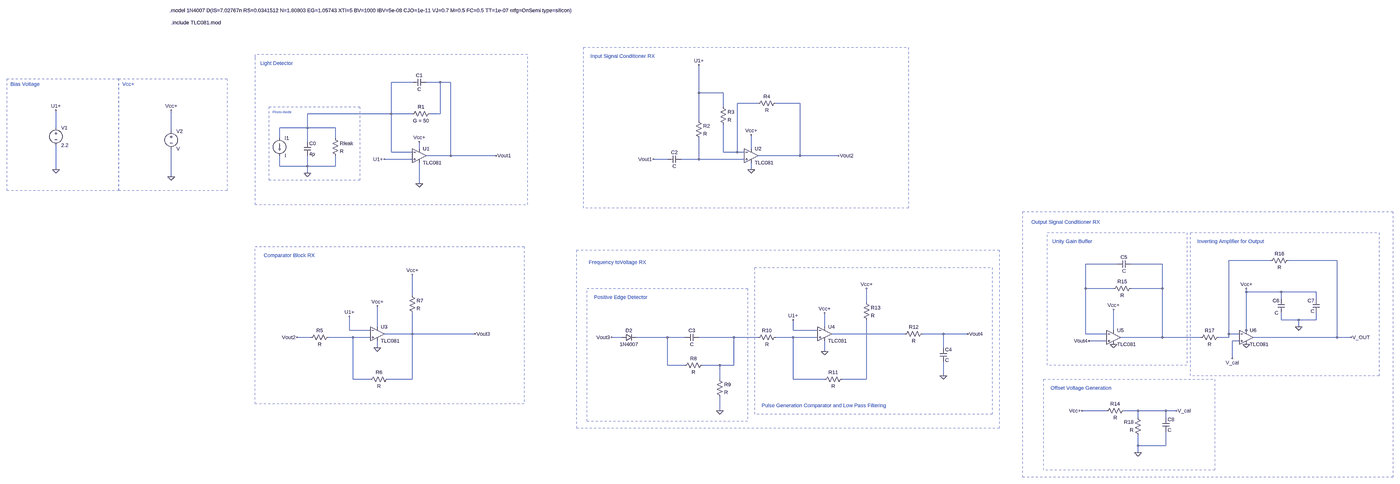
[diagram p0: schematic Receiver-design.asc, whole sheet]
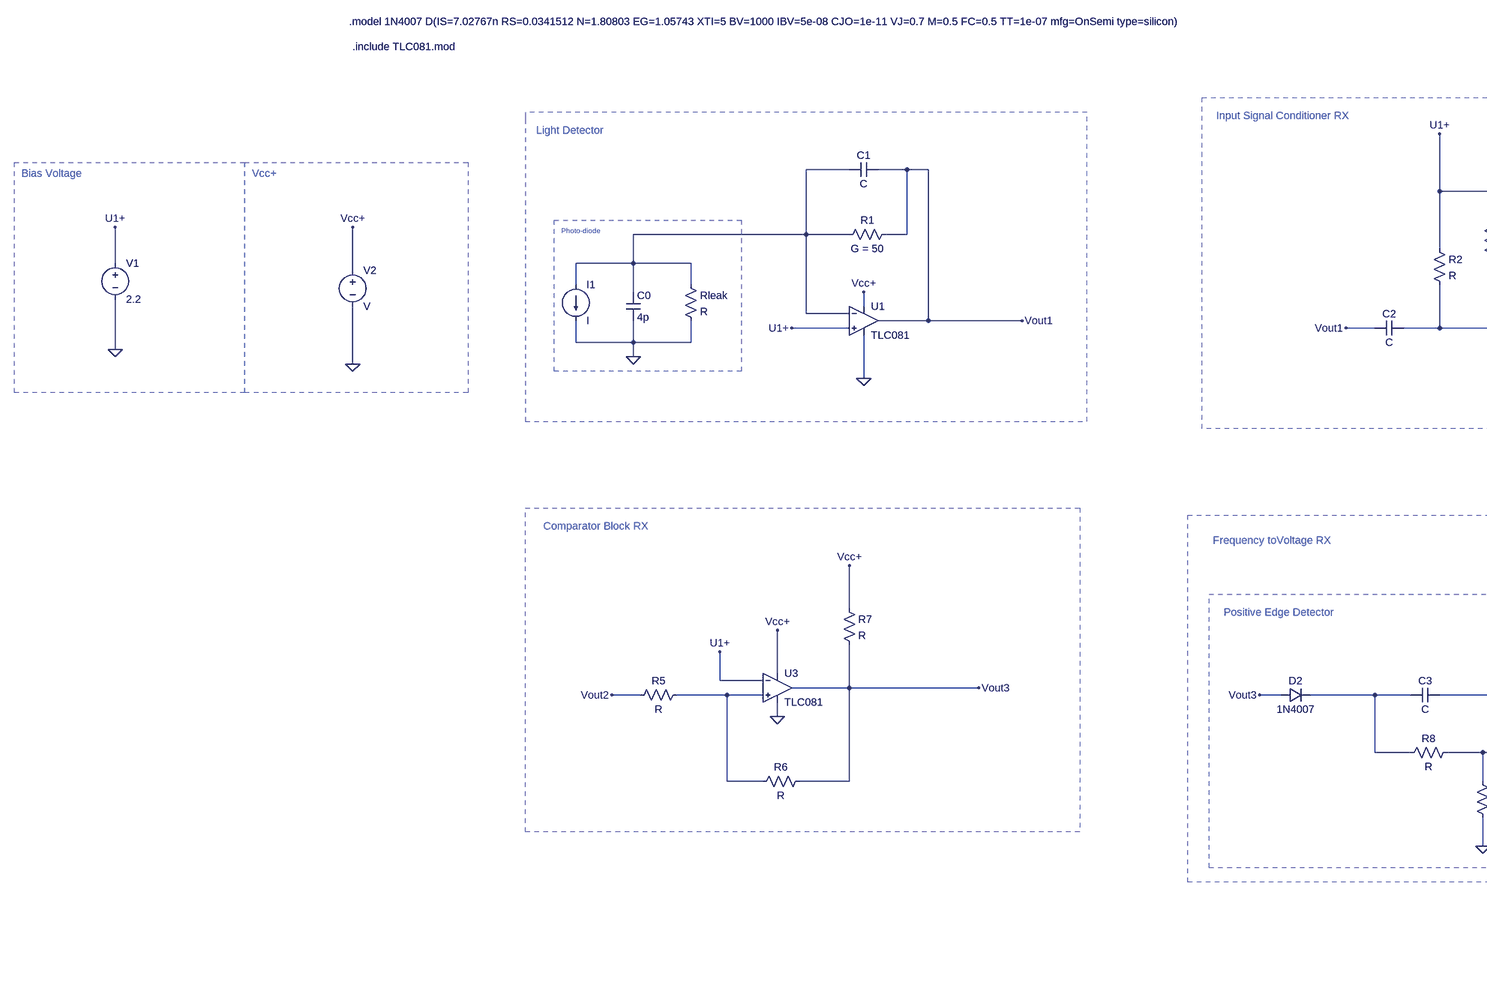
[diagram p1: schematic Receiver-design.asc, part, row 1 of 1, column 1 of 2]
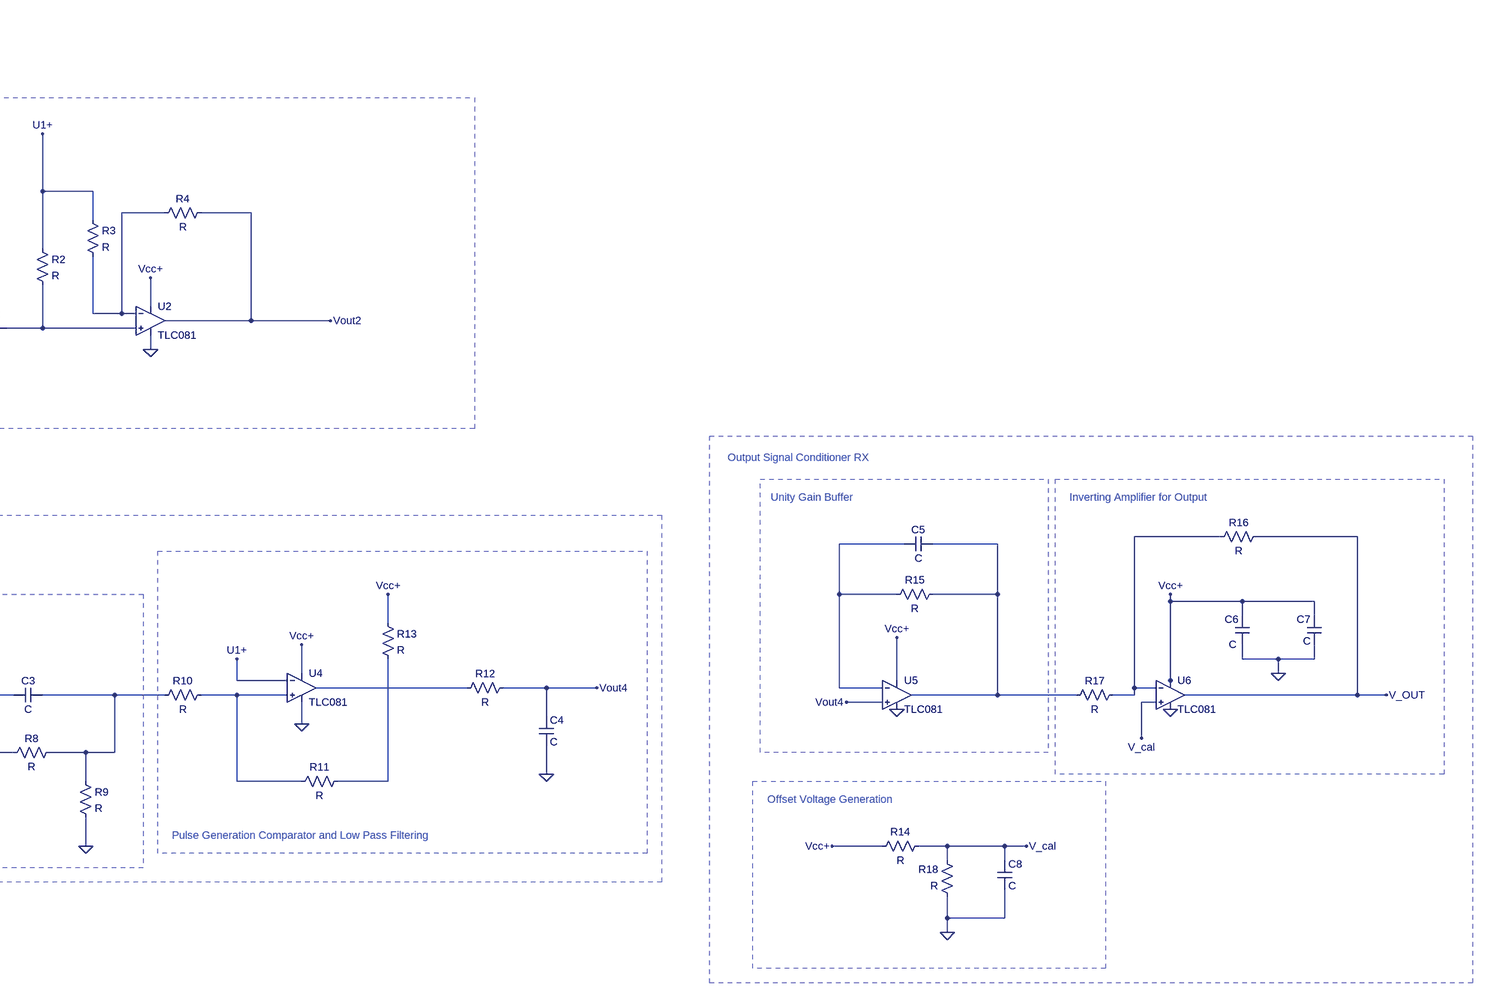
[diagram p2: schematic Receiver-design.asc, part, row 1 of 1, column 2 of 2]
Receiver-design.asc, the LTspice schematic file:
Version 4
SHEET 1 5204 1204
WIRE 704 -608 608 -608
WIRE 832 -608 768 -608
WIRE 880 -608 832 -608
WIRE 2016 -560 2016 -688
WIRE 2128 -560 2016 -560
WIRE 2288 -512 2192 -512
WIRE 2480 -512 2368 -512
WIRE 2128 -496 2128 -560
WIRE 608 -464 608 -608
WIRE 608 -464 224 -464
WIRE 704 -464 608 -464
WIRE 832 -464 832 -608
WIRE 832 -464 784 -464
WIRE 2016 -432 2016 -560
WIRE -928 -400 -928 -480
WIRE 224 -400 224 -464
WIRE 224 -400 96 -400
WIRE 352 -400 224 -400
WIRE -400 -384 -400 -480
WIRE 96 -352 96 -400
WIRE 352 -352 352 -400
WIRE 224 -336 224 -400
WIRE 736 -304 736 -336
WIRE 2256 -304 2256 -368
WIRE 608 -288 608 -464
WIRE 704 -288 608 -288
WIRE 2128 -288 2128 -416
WIRE 2192 -288 2192 -512
WIRE 2192 -288 2128 -288
WIRE 2224 -288 2192 -288
WIRE 880 -272 880 -608
WIRE 880 -272 768 -272
WIRE 1088 -272 880 -272
WIRE 2480 -272 2480 -512
WIRE 2480 -272 2288 -272
WIRE 2656 -272 2480 -272
WIRE 704 -256 576 -256
WIRE 1872 -256 1808 -256
WIRE 2016 -256 2016 -352
WIRE 2016 -256 1936 -256
WIRE 2224 -256 2016 -256
WIRE 96 -224 96 -272
WIRE 224 -224 224 -272
WIRE 224 -224 96 -224
WIRE 352 -224 352 -272
WIRE 352 -224 224 -224
WIRE -928 -208 -928 -320
WIRE 2256 -208 2256 -240
WIRE 224 -192 224 -224
WIRE -400 -176 -400 -304
WIRE 736 -144 736 -240
WIRE 4640 208 4448 208
WIRE 4944 208 4720 208
WIRE 3936 224 3792 224
WIRE 4144 224 4000 224
WIRE 3792 336 3792 224
WIRE 3920 336 3792 336
WIRE 4144 336 4144 224
WIRE 4144 336 4000 336
WIRE 4528 352 4528 336
WIRE 4688 352 4528 352
WIRE 4848 352 4688 352
WIRE 704 368 704 272
WIRE 4688 384 4688 352
WIRE 4848 384 4848 352
WIRE 2784 400 2784 336
WIRE 4688 480 4688 448
WIRE 4768 480 4688 480
WIRE 4848 480 4848 448
WIRE 4848 480 4768 480
WIRE 544 512 544 416
WIRE 2592 512 2592 448
WIRE 4768 512 4768 480
WIRE 416 528 416 464
WIRE 512 528 416 528
WIRE 2448 528 2448 480
WIRE 2560 528 2448 528
WIRE 3920 528 3920 432
WIRE 4528 528 4528 352
WIRE 704 544 704 448
WIRE 704 544 576 544
WIRE 992 544 704 544
WIRE 2960 544 2624 544
WIRE 3136 544 3040 544
WIRE 3248 544 3136 544
WIRE 3792 544 3792 336
WIRE 3888 544 3792 544
WIRE 4448 544 4448 208
WIRE 4496 544 4448 544
WIRE 4528 544 4528 528
WIRE 240 560 176 560
WIRE 432 560 320 560
WIRE 512 560 432 560
WIRE 1664 560 1616 560
WIRE 1872 560 1728 560
WIRE 1952 560 1872 560
WIRE 2176 560 2016 560
WIRE 2288 560 2176 560
WIRE 2448 560 2368 560
WIRE 2560 560 2448 560
WIRE 4144 560 4144 336
WIRE 4144 560 3952 560
WIRE 4320 560 4144 560
WIRE 4448 560 4448 544
WIRE 4448 560 4400 560
WIRE 4944 560 4944 208
WIRE 4944 560 4560 560
WIRE 5008 560 4944 560
WIRE 3888 576 3808 576
WIRE 4496 576 4464 576
WIRE 544 608 544 576
WIRE 3136 608 3136 544
WIRE 2592 624 2592 576
WIRE 4464 656 4464 576
WIRE 1872 688 1872 560
WIRE 1952 688 1872 688
WIRE 2112 688 2032 688
WIRE 2176 688 2176 560
WIRE 2176 688 2112 688
WIRE 3136 736 3136 672
WIRE 432 752 432 560
WIRE 512 752 432 752
WIRE 704 752 704 544
WIRE 704 752 592 752
WIRE 2112 752 2112 688
WIRE 2448 752 2448 560
WIRE 2592 752 2448 752
WIRE 2784 752 2784 480
WIRE 2784 752 2672 752
WIRE 2112 896 2112 832
WIRE 3888 896 3776 896
WIRE 4032 896 3968 896
WIRE 4160 896 4032 896
WIRE 4208 896 4160 896
WIRE 4032 928 4032 896
WIRE 4160 928 4160 896
WIRE 4032 1056 4032 1008
WIRE 4160 1056 4160 992
WIRE 4160 1056 4032 1056
WIRE 4032 1088 4032 1056
FLAG 224 -192 0
FLAG 736 -144 0
FLAG 736 -336 Vcc+
FLAG 576 -256 U1+
FLAG 1088 -272 Vout1
FLAG 2256 -208 0
FLAG 2256 -368 Vcc+
FLAG 1808 -256 Vout1
FLAG 2656 -272 Vout2
FLAG 176 560 Vout2
FLAG 544 608 0
FLAG 544 416 Vcc+
FLAG 704 272 Vcc+
FLAG 992 544 Vout3
FLAG 2112 896 0
FLAG 1616 560 Vout3
FLAG 2592 624 0
FLAG 2592 448 Vcc+
FLAG 2784 336 Vcc+
FLAG 3136 736 0
FLAG 3248 544 Vout4
FLAG 2448 480 U1+
FLAG 416 464 U1+
FLAG 2016 -688 U1+
FLAG -928 -480 U1+
FLAG -928 -208 0
FLAG 3920 592 0
FLAG 4528 592 0
FLAG 4032 1088 0
FLAG 4768 512 0
FLAG 3920 432 Vcc+
FLAG 4528 336 Vcc+
FLAG 3808 576 Vout4
FLAG 3776 896 Vcc+
FLAG 4208 896 V_cal
FLAG 4464 656 V_cal
FLAG 5008 560 V_OUT
FLAG -400 -176 0
FLAG -400 -480 Vcc+
SYMBOL res 800 -480 R90
WINDOW 0 0 56 VBottom 2
WINDOW 3 32 56 VTop 2
SYMATTR InstName R1
SYMATTR Value G = 50
SYMBOL cap 768 -624 R90
WINDOW 0 0 32 VBottom 2
WINDOW 3 32 32 VTop 2
SYMATTR InstName C1
SYMBOL OpAmps\\opamp2 736 -336 R0
SYMATTR InstName U1
SYMATTR Value TLC081
SYMBOL cap 1936 -272 R90
WINDOW 0 0 32 VBottom 2
WINDOW 3 32 32 VTop 2
SYMATTR InstName C2
SYMBOL OpAmps\\opamp2 2256 -336 R0
SYMATTR InstName U2
SYMATTR Value TLC081
SYMBOL res 2000 -448 R0
SYMATTR InstName R2
SYMBOL res 2112 -512 R0
SYMATTR InstName R3
SYMBOL res 2384 -528 R90
WINDOW 0 0 56 VBottom 2
WINDOW 3 32 56 VTop 2
SYMATTR InstName R4
SYMBOL OpAmps\\opamp2 544 480 R0
SYMATTR InstName U3
SYMATTR Value TLC081
SYMBOL res 336 544 R90
WINDOW 0 0 56 VBottom 2
WINDOW 3 32 56 VTop 2
SYMATTR InstName R5
SYMBOL res 608 736 R90
WINDOW 0 0 56 VBottom 2
WINDOW 3 32 56 VTop 2
SYMATTR InstName R6
SYMBOL res 688 352 R0
SYMATTR InstName R7
SYMBOL OpAmps\\opamp2 2592 480 R0
SYMATTR InstName U4
SYMATTR Value TLC081
SYMBOL diode 1664 576 R270
WINDOW 0 32 32 VTop 2
WINDOW 3 0 32 VBottom 2
SYMATTR InstName D2
SYMATTR Value 1N4007
SYMBOL cap 2016 544 R90
WINDOW 0 0 32 VBottom 2
WINDOW 3 32 32 VTop 2
SYMATTR InstName C3
SYMBOL res 2048 672 R90
WINDOW 0 0 56 VBottom 2
WINDOW 3 32 56 VTop 2
SYMATTR InstName R8
SYMBOL res 2096 736 R0
SYMATTR InstName R9
SYMBOL res 2384 544 R90
WINDOW 0 0 56 VBottom 2
WINDOW 3 32 56 VTop 2
SYMATTR InstName R10
SYMBOL res 2688 736 R90
WINDOW 0 0 56 VBottom 2
WINDOW 3 32 56 VTop 2
SYMATTR InstName R11
SYMBOL res 3056 528 R90
WINDOW 0 0 56 VBottom 2
WINDOW 3 32 56 VTop 2
SYMATTR InstName R12
SYMBOL res 2768 384 R0
SYMATTR InstName R13
SYMBOL cap 3120 608 R0
SYMATTR InstName C4
SYMBOL voltage -928 -416 R0
WINDOW 123 0 0 Left 0
WINDOW 39 0 0 Left 0
SYMATTR InstName V1
SYMATTR Value 2.2
SYMBOL current 96 -352 R0
SYMATTR InstName I1
SYMBOL cap 208 -336 R0
SYMATTR InstName C0
SYMATTR Value 4p
SYMBOL res 336 -368 R0
SYMATTR InstName Rleak
SYMBOL res 4016 320 R90
WINDOW 0 0 56 VBottom 2
WINDOW 3 32 56 VTop 2
SYMATTR InstName R15
SYMBOL res 4736 192 R90
WINDOW 0 0 56 VBottom 2
WINDOW 3 32 56 VTop 2
SYMATTR InstName R16
SYMBOL res 4416 544 R90
WINDOW 0 0 56 VBottom 2
WINDOW 3 32 56 VTop 2
SYMATTR InstName R17
SYMBOL cap 4000 208 R90
WINDOW 0 0 32 VBottom 2
WINDOW 3 32 32 VTop 2
SYMATTR InstName C5
SYMBOL cap 4704 448 R180
WINDOW 0 24 56 Left 2
WINDOW 3 29 0 Left 2
SYMATTR InstName C6
SYMBOL cap 4864 448 R180
WINDOW 0 24 56 Left 2
WINDOW 3 24 8 Left 2
SYMATTR InstName C7
SYMBOL OpAmps\\opamp2 3920 496 R0
SYMATTR InstName U5
SYMATTR Value TLC081
SYMBOL OpAmps\\opamp2 4528 496 R0
SYMATTR InstName U6
SYMATTR Value TLC081
SYMBOL res 3984 880 R90
WINDOW 0 0 56 VBottom 2
WINDOW 3 32 56 VTop 2
SYMATTR InstName R14
SYMBOL res 4048 1024 R180
WINDOW 0 36 76 Left 2
WINDOW 3 36 40 Left 2
SYMATTR InstName R18
SYMBOL cap 4144 928 R0
SYMATTR InstName C8
SYMBOL voltage -400 -400 R0
SYMATTR InstName V2
TEXT -408 -976 Left 2 !.model 1N4007 D(IS=7.02767n RS=0.0341512 N=1.80803 EG=1.05743 XTI=5 BV=1000 IBV=5e-08 CJO=1e-11 VJ=0.7 M=0.5 FC=0.5 TT=1e-07 mfg=OnSemi type=silicon)
TEXT -400 -920 Left 2 !.include TLC081.mod
TEXT 8 -696 Left 2 ;Light Detector
TEXT 1520 -728 Left 2 ;Input Signal Conditioner RX
TEXT 24 184 Left 2 ;Comparator Block RX
TEXT 1512 216 Left 2 ;Frequency toVoltage RX
TEXT 1536 376 Left 2 ;Positive Edge Detector
TEXT 2304 872 Left 2 ;Pulse Generation Comparator and Low Pass Filtering
TEXT 3544 32 Left 2 ;Output Signal Conditioner RX
TEXT 3640 120 Left 2 ;Unity Gain Buffer
TEXT 4304 120 Left 2 ;Inverting Amplifier for Output
TEXT 3632 792 Left 2 ;Offset Voltage Generation
TEXT -1136 -600 Left 2 ;Bias Voltage
TEXT -624 -600 Left 2 ;Vcc+
TEXT 64 -472 Left 1 ;Photo-diode
LINE Normal 1232 -736 -16 -736 2
LINE Normal 1232 -48 1232 -736 2
LINE Normal -16 -48 1232 -48 2
LINE Normal -16 -720 -16 -48 2
LINE Normal -16 -736 -16 -720 2
RECTANGLE Normal 2976 -32 1488 -768 2
RECTANGLE Normal 1216 864 -16 144 2
RECTANGLE Normal 3392 976 1456 160 2
RECTANGLE Normal 2240 944 1504 336 2
RECTANGLE Normal 3360 912 2272 240 2
RECTANGLE Normal 5200 1200 3504 -16 2
RECTANGLE Normal 4256 688 3616 80 2
RECTANGLE Normal 5136 736 4272 80 2
RECTANGLE Normal 4384 1168 3600 752 2
RECTANGLE Normal -640 -112 -1152 -624 2
RECTANGLE Normal -144 -112 -640 -624 2
RECTANGLE Normal 464 -160 48 -496 2

The netlist it stands for:
* Receiver-design.asc
R1 Vout1 N001 G = 50
C1 Vout1 N001 C
XU1 U1+ N001 Vcc+ 0 Vout1 TLC081  ; pins In+ In- V+ V- OUT
C2 N003 Vout1 C
XU2 N003 N002 Vcc+ 0 Vout2 TLC081  ; pins In+ In- V+ V- OUT
R2 U1+ N003 R
R3 U1+ N002 R
R4 Vout2 N002 R
XU3 N008 U1+ Vcc+ 0 Vout3 TLC081  ; pins In+ In- V+ V- OUT
R5 N008 Vout2 R
R6 Vout3 N008 R
R7 Vcc+ Vout3 R
XU4 N011 U1+ Vcc+ 0 N007 TLC081  ; pins In+ In- V+ V- OUT
D2 Vout3 N009 1N4007
C3 N010 N009 C
R8 N010 N009 R
R9 N010 0 R
R10 N011 N010 R
R11 N012 N011 R
R12 Vout4 N007 R
R13 Vcc+ N012 R
C4 Vout4 0 C
V1 U1+ 0 2.2
I1 N001 0 I
C0 N001 0 4p
Rleak N001 0 R
R15 N006 N005 R
R16 V_OUT N004 R
R17 N004 N006 R
C5 N006 N005 C
C6 0 Vcc+ C
C7 0 Vcc+ C
XU5 Vout4 N005 Vcc+ 0 N006 TLC081  ; pins In+ In- V+ V- OUT
XU6 V_cal N004 Vcc+ 0 V_OUT TLC081  ; pins In+ In- V+ V- OUT
R14 V_cal Vcc+ R
R18 0 V_cal R
C8 V_cal 0 C
V2 Vcc+ 0 V
.model D D
.lib standard.dio
.model 1N4007 D(IS=7.02767n RS=0.0341512 N=1.80803 EG=1.05743 XTI=5 BV=1000 IBV=5e-08 CJO=1e-11 VJ=0.7 M=0.5 FC=0.5 TT=1e-07 mfg=OnSemi type=silicon)
.include TLC081.mod
* Light Detector
* Input Signal Conditioner RX
* Comparator Block RX
* Frequency toVoltage RX
* Positive Edge Detector
* Pulse Generation Comparator and Low Pass Filtering
* Output Signal Conditioner RX
* Unity Gain Buffer
* Inverting Amplifier for Output
* Offset Voltage Generation
* Bias Voltage
* Vcc+
* Photo-diode
.backanno
.end